# EAGLE design TMC2209_Camera_Slider_PCB_revB (EAGLE 9.6.2)
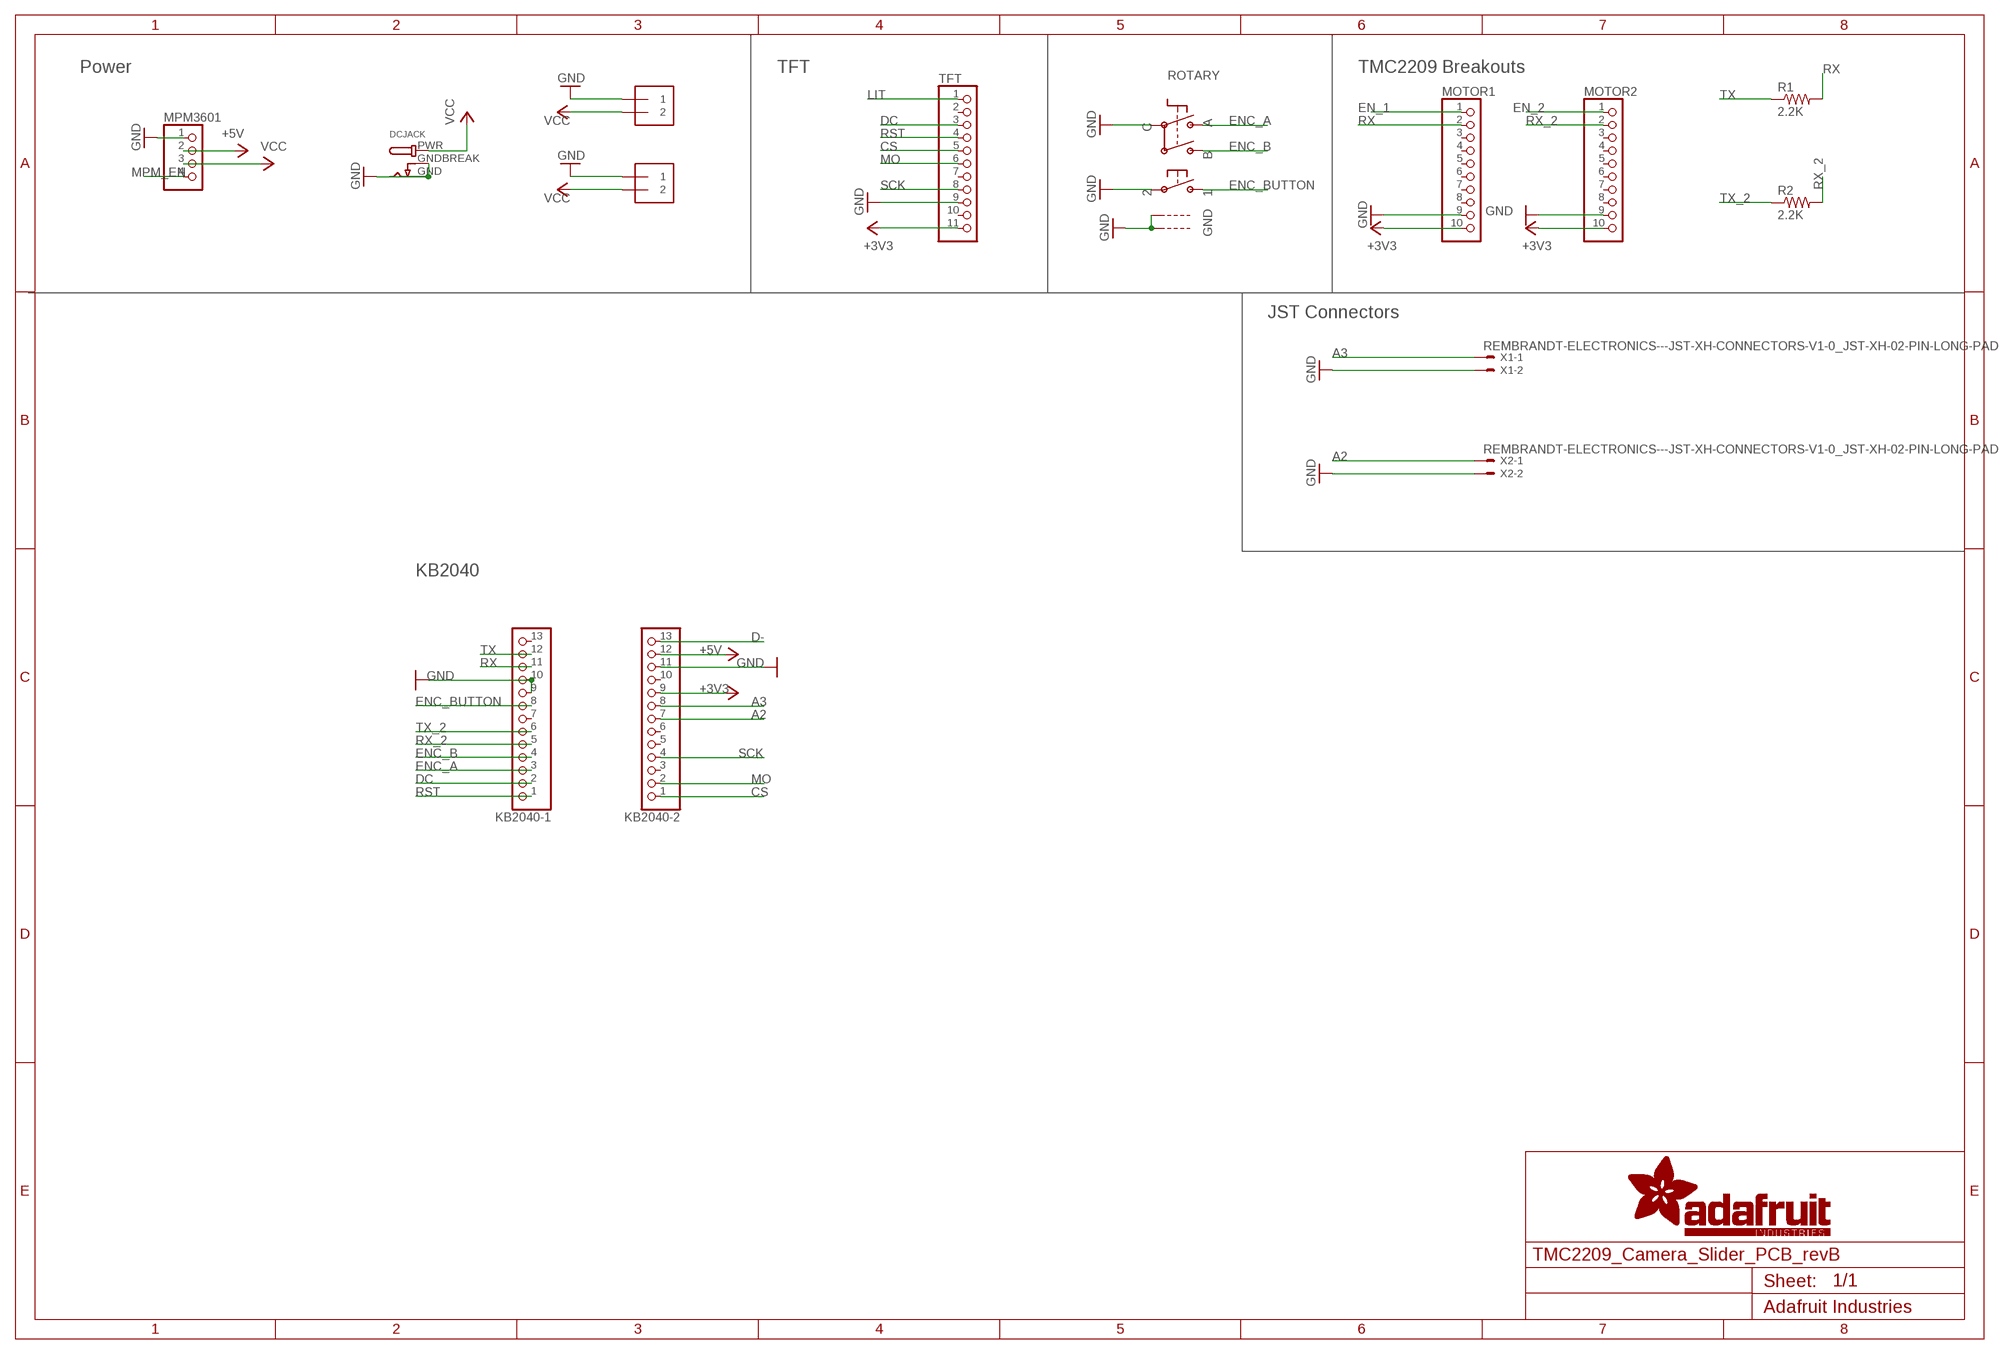
[diagram p0: schematic, sheet 1]

## Parts
DCJACK  DCBARRELPTH  [DCJACK_2MM_PTH]
J1  1X2-3.5MM  [1X2-3.5MM]
J2  1X2-3.5MM  [1X2-3.5MM]
KB2040-1  HEADER-1X13  [1X13_ROUND_70]
KB2040-2  HEADER-1X13  [1X13_ROUND_70]
MOTOR1  HEADER-1X10  [1X10_OVAL]
MOTOR2  HEADER-1X10  [1X10_OVAL]
MPM3601  HEADER-1X4  [1X04_OVAL]
R1  2.2K  R-US_0309/12  [0309/12]
R2  2.2K  R-US_0309/12  [0309/12]
ROTARY  ENCODER_PLUS_SWITCH_BOURNS_PEC11  [PEC11+SWITCH]
TFT  HEADER-1X11  [1X11_ROUND]
X1  REMBRANDT-ELECTRONICS---JST-XH-CONNECTORS-V1-0_JST-XH-02-PIN-LONG-PAD  [REMBRANDT-ELECTRONICS---JST-XH-CONNECTORS-V1-0_JST-XH-02-PACKAGE-LONG-PAD]
X2  REMBRANDT-ELECTRONICS---JST-XH-CONNECTORS-V1-0_JST-XH-02-PIN-LONG-PAD  [REMBRANDT-ELECTRONICS---JST-XH-CONNECTORS-V1-0_JST-XH-02-PACKAGE-LONG-PAD]

## Nets
+3V3: KB2040-2.9 MOTOR1.10 MOTOR2.10 TFT.11
+5V: KB2040-2.12 MPM3601.2
A2: KB2040-2.7 X2.1
A3: KB2040-2.8 X1.1
CS: KB2040-2.1 TFT.5
D-: KB2040-2.13
DC: KB2040-1.2 TFT.3
EN_1: MOTOR1.1
EN_2: MOTOR2.1
ENC_A: KB2040-1.3 ROTARY.P$A
ENC_B: KB2040-1.4 ROTARY.P$B
ENC_BUTTON: KB2040-1.8 ROTARY.P$1
GND: DCJACK.GND DCJACK.GNDBREAK J1.1 J2.1 KB2040-1.9 KB2040-1.10 KB2040-2.11 MOTOR1.9 MOTOR2.9 MPM3601.1 ROTARY.P$2 ROTARY.P$C ROTARY.P$GND1 ROTARY.P$GND2 TFT.9 X1.2 X2.2
LIT: TFT.1
MO: KB2040-2.2 TFT.6
MPM_EN: MPM3601.4
RST: KB2040-1.1 TFT.4
RX: KB2040-1.11 MOTOR1.2 R1.2
RX_2: KB2040-1.5 MOTOR2.2 R2.2
SCK: KB2040-2.4 TFT.8
TX: KB2040-1.12 R1.1
TX_2: KB2040-1.6 R2.1
VCC: DCJACK.PWR J1.2 J2.2 MPM3601.3
Unconnected: KB2040-1.7 KB2040-1.13 KB2040-2.3 KB2040-2.5 KB2040-2.6 KB2040-2.10 MOTOR1.3 MOTOR1.4 MOTOR1.5 MOTOR1.6 MOTOR1.7 MOTOR1.8 MOTOR2.3 MOTOR2.4 MOTOR2.5 MOTOR2.6 MOTOR2.7 MOTOR2.8 TFT.2 TFT.7 TFT.10

## Notes on the sheet
- Power | TFT | TMC2209 Breakouts
- JST Connectors
- KB2040

## Library data of the parts
DCJACK = adafruit_electromech:DCBARREL: DC Barrel Jack DCJACK_1.3MM_PTH - Through Hole 1.3mm Jack (4UConnector: 05536) DCJACK_2MM_PTH - Through Hole 2.0/2.1 Jack (4UConnector: 05537) DCJACK_2MM_SMT - SMT 2.0/2.1mm Jack(4UConnector: 03267)
J1 J2 = adafruit:1X2: 3.5mm Terminal block http://www.ladyada.net/library/pcb/eaglelibrary.html
KB2040-1 KB2040-2 = microbuilder:HEADER-1X13
MOTOR1 MOTOR2 = microbuilder:HEADER-1X10: PIN HEADER
MPM3601 = microbuilder:HEADER-1X4: PIN HEADER
R1 R2 = adafruit:R-US_: RESISTOR, American symbol
ROTARY = adafruit_electromech:ENCODER_PLUS_SWITCH: Rotary Encoder with Built-In Switch PEC11 - 24 Step, PEC11-4215F-S24 - http://www.adafruit.com/products/377
TFT = microbuilder:HEADER-1X11
X1 X2 = thermalBonnet:REMBRANDT-ELECTRONICS---JST-XH-CONNECTORS-V1-0_JST-XH-02-PIN: JST XH Connector 2 Pin Wire to board connector. Pitch: 2,54 mm, (0.100") Number of pins: 2 Created by Rembrandt Electronics www.rembrandtelectronics.com

## Board
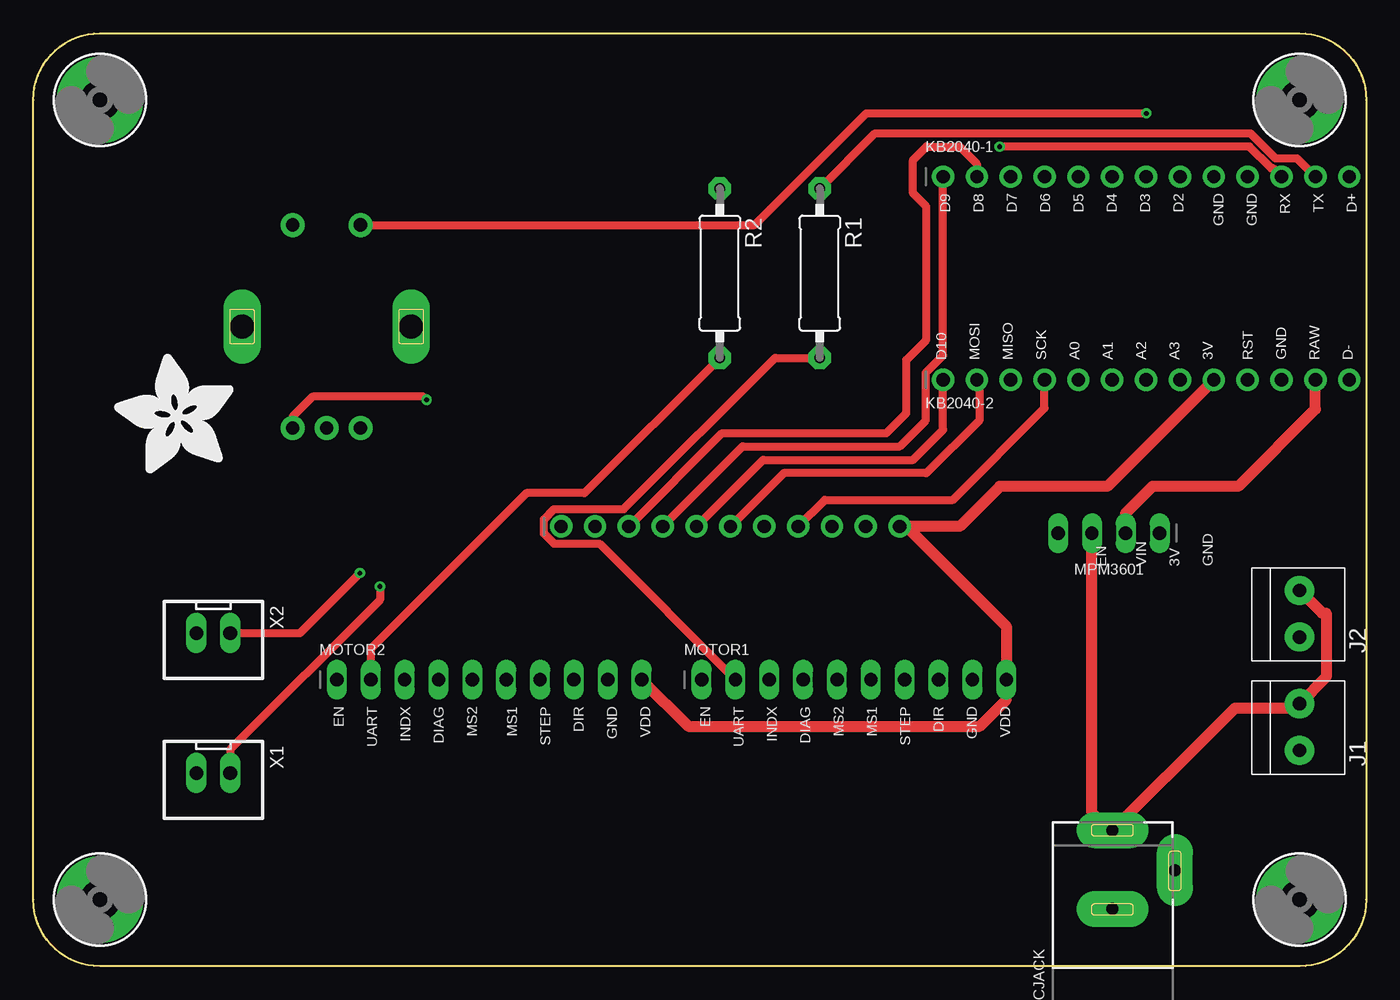
[diagram p1: board, top side]
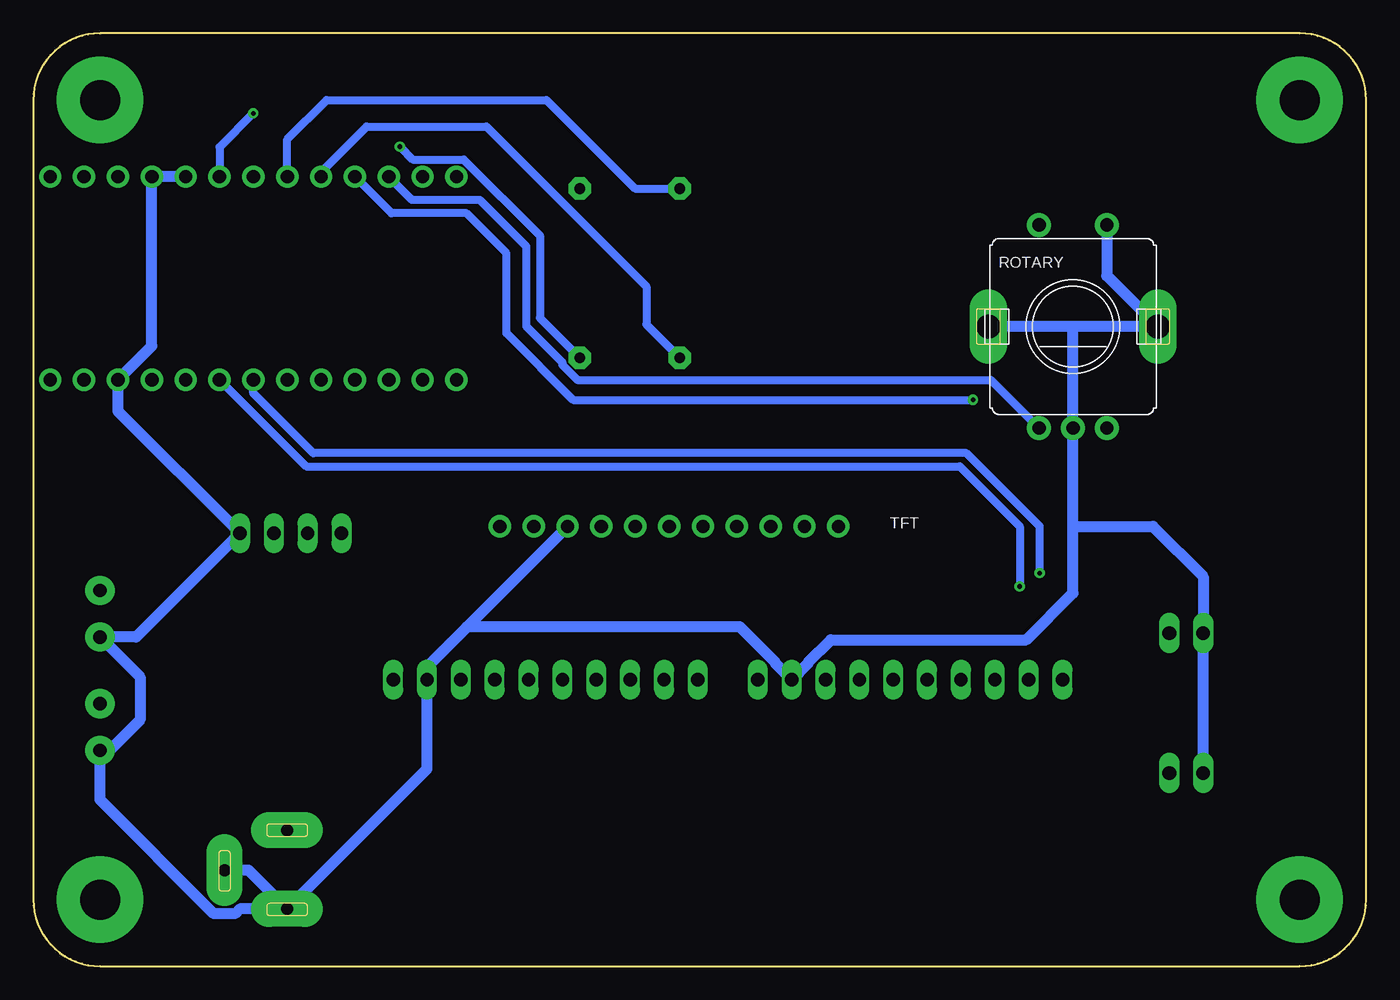
[diagram p2: board, bottom side, seen from below]

Size 100 x 70 mm. Coordinates in mm from the lower left corner, seen from the top.
Outline: 95,0 5,0 arc-90 0,5 0,65 arc-90 5,70 95,70 arc-90 100,65 100,5 arc-90 95,0
Copper layers (1*16): Top 0.035mm / dielectric 1.5mm / Bottom 0.035mm
Design rules "default *": minimum track width 6mil, minimum drill 0.35mm, track to track 6mil, track to pad 6mil, pad to pad 6mil, via to via 6mil, smd to smd 6mil, copper to edge 10mil, drill to drill 6mil, minimum pad ring 10mil, minimum via ring 8mil, stop-mask expansion 4mil, vias tented up to drill 0mil, thermal gap 10mil

### Footprints (pad centres in the part's own frame; a part is rotated, then mirrored left to right if it is on the bottom)
DCJACK_2MM_PTH = drill 0.9 pad 2.7 long: GND -2.9,2.54; GNDBREAK 0,-2.16; PWR 3,2.54
MOUNTINGHOLE_3.0_PLATED = drill 3 pad 6.452: P$1 0,0
1X2-3.5MM = drill 1 pad 2.184: 1 1.8,0; 2 -1.7,0
1X13_ROUND_70 = drill 1 pad 1.676: 1 -15.24,0; 2 -12.7,0; 3 -10.16,0; 4 -7.62,0; 5 -5.08,0; 6 -2.54,0; 7 0,0; 8 2.54,0; 9 5.08,0; 10 7.62,0; 11 10.16,0; 12 12.7,0; 13 15.24,0
1X10_OVAL = drill 1 long: 1 -11.43,0; 2 -8.89,0; 3 -6.35,0; 4 -3.81,0; 5 -1.27,0; 6 1.27,0; 7 3.81,0; 8 6.35,0; 9 8.89,0; 10 11.43,0
1X04_OVAL = drill 1 long: 1 -3.81,0; 2 -1.27,0; 3 1.27,0; 4 3.81,0
0309/12 = drill 0.813 pad 1.676 octagon: 1 -6.35,0; 2 6.35,0
PEC11+SWITCH = drill 1 pad 1.8: P$1 -2.54,7.62; P$2 2.54,7.62; P$A -2.54,-7.62; P$B 2.54,-7.62; P$C 0,-7.62 | drill 1.8 pad 2.8 long: P$GND1 -6.35,0; P$GND2 6.35,0
1X11_ROUND = drill 1 pad 1.676: 1 -12.7,0; 2 -10.16,0; 3 -7.62,0; 4 -5.08,0; 5 -2.54,0; 6 0,0; 7 2.54,0; 8 5.08,0; 9 7.62,0; 10 10.16,0; 11 12.7,0
REMBRANDT-ELECTRONICS---JST-XH-CONNECTORS-V1-0_JST-XH-02-PACKAGE-LONG-PAD = drill 1.016 long: 1 -1.27,0; 2 1.27,0

### Placement (x,y rotation side)
DCJACK  83.5,7.2 90 top
E$1  [MOUNTINGHOLE_3.0_PLATED]  5,65 0 top
E$2  [MOUNTINGHOLE_3.0_PLATED]  95,65 0 top
E$3  [MOUNTINGHOLE_3.0_PLATED]  95,5 0 top
E$5  [MOUNTINGHOLE_3.0_PLATED]  5,5 0 top
J1  95,18 270 top
J2  95,26.5 270 top
KB2040-1  83.49,59.24 0 top
KB2040-2  83.49,44 0 top
MOTOR1  61.57,21.5 0 top
MOTOR2  34.21,21.5 0 top
MPM3601  80.69,32.5 180 top
PLABEL0  [PLABEL0]  88,19 0 top
PLABEL1  [PLABEL6]  49,52.5 90 top
PLABEL2  [PLABEL2]  61.5,25 0 top
PLABEL3  [PLABEL3]  34,25 0 top
PLABEL4  [PLABEL4]  4.5,15.5 0 top
PLABEL5  [PLABEL5]  4.5,24 0 top
PLABEL6  [PLABEL6]  56.5,52.5 90 top
PLABEL7  [PLABEL1]  87,23.5 0 top
PLABEL8  [PLABEL8]  84.5,35 0 top
PLABEL9  [PLABEL9]  79.5,35 0 top
PLABEL10  [PLABEL10]  45.5,18 90 top
PLABEL11  [PLABEL11]  73,18 90 top
PLABEL12  [PLABEL12]  83.5,52 0 top
PLABEL13  [PLABEL13]  98.5,52 90 top
PLABEL14  [PLABEL14]  80.5,29.5 0 top
PLABEL15  [PLABEL15]  78,14 0 top
PLABEL16  [PLABEL16]  95,12 0 top
PLABEL17  [PLABEL17]  75.5,51 0 top
PLABEL18  [PLABEL18]  39.5,8 0 top
PLABEL19  [PLABEL19]  67,8 0 top
PLABEL21  [PLABEL21]  12.5,59.5 0 top
PLABEL24  [PLABEL24]  23,57 0 bottom
PLABEL25  [PLABEL25]  53,37.5 0 bottom
PLABEL26  [PLABEL26]  65,30.5 0 bottom
PLABEL27  [PLABEL27]  60,30.5 0 bottom
PLABEL28  [PLABEL28]  57.25,30.5 0 bottom
PLABEL29  [PLABEL29]  52.25,30.5 0 bottom
PLABEL30  [PLABEL30]  54.75,30.5 0 bottom
PLABEL31  [PLABEL31]  49.75,30.5 0 bottom
PLABEL32  [PLABEL32]  47.25,30.5 0 bottom
PLABEL33  [PLABEL33]  44.75,30.5 0 bottom
PLABEL34  [PLABEL34]  44.75,29.5 0 bottom
PLABEL35  [PLABEL35]  47.25,29.5 0 bottom
PLABEL36  [PLABEL36]  49.75,29.5 0 bottom
PLABEL41  [PLABEL41]  40.5,7 0 bottom
PLABEL42  [PLABEL42]  12,56.5 15 bottom
PLABEL43  [PLABEL43]  34.5,42.5 15 bottom
PLABEL44  [PLABEL44]  18,60.5 15 bottom
PLABEL45  [PLABEL45]  54,61 15 bottom
PLABEL46  [PLABEL46]  39,16.5 15 bottom
PLABEL47  [PLABEL47]  90,29 15 bottom
PLABEL48  [PLABEL48]  86,48.5 15 bottom
PLABEL49  [PLABEL49]  83,25 15 bottom
PLABEL50  [PLABEL50]  27,67 15 bottom
PLABEL51  [PLABEL51]  17.5,31 15 bottom
PLABEL52  [PLABEL52]  4,26.5 15 bottom
PLABEL53  [PLABEL53]  72.5,4 15 bottom
PLABEL54  [PLABEL54]  75.5,29 15 bottom
PLABEL55  [PLABEL55]  87.5,37.5 15 bottom
PLABEL56  [PLABEL56]  72,53.5 15 bottom
PLABEL57  [PLABEL57]  55,52.5 15 bottom
PLABEL58  [PLABEL58]  57,4 15 bottom
PLABEL59  [PLABEL59]  86,68 15 bottom
PLABEL60  [PLABEL60]  85,55.5 15 bottom
PLABEL61  [PLABEL61]  33.5,52.5 345 bottom
PLABEL62  [PLABEL62]  44.5,53.5 345 bottom
PLABEL63  [PLABEL63]  4,58.5 345 bottom
PLABEL64  [PLABEL64]  11,47 345 bottom
PLABEL65  [PLABEL65]  6.5,39 345 bottom
PLABEL66  [PLABEL66]  76,48 345 bottom
PLABEL67  [PLABEL67]  35.5,60 345 bottom
PLABEL68  [PLABEL68]  65.5,14 345 bottom
PLABEL69  [PLABEL69]  46,62 345 bottom
PLABEL70  [PLABEL70]  14.5,6.5 345 bottom
PLABEL71  [PLABEL71]  85.5,17.5 345 bottom
PLABEL72  [PLABEL72]  53.5,27.5 345 bottom
PLABEL73  [PLABEL73]  35,29 345 bottom
PLABEL74  [PLABEL74]  28.5,36 345 bottom
PLABEL75  [PLABEL75]  16.5,68 345 bottom
PLABEL76  [PLABEL76]  61,67 345 top
PLABEL77  [PLABEL77]  25.5,60 15 top
PLABEL78  [PLABEL78]  3.5,48.5 15 top
PLABEL79  [PLABEL79]  91,12.5 15 top
PLABEL80  [PLABEL80]  19.5,14.5 15 top
PLABEL81  [PLABEL81]  23,3 15 top
PLABEL82  [PLABEL82]  38.5,65 15 top
PLABEL83  [PLABEL83]  76,19.5 15 top
PLABEL84  [PLABEL84]  94,53.5 15 top
PLABEL85  [PLABEL85]  76.5,65.5 15 top
PLABEL86  [PLABEL86]  37.5,47 15 top
PLABEL87  [PLABEL87]  9,62.5 345 top
PLABEL88  [PLABEL88]  5.5,32 345 top
PLABEL89  [PLABEL89]  2.5,12 345 top
PLABEL90  [PLABEL90]  41,39 345 top
PLABEL91  [PLABEL91]  48.5,66.5 345 top
PLABEL92  [PLABEL92]  92.5,33 345 top
PLABEL93  [PLABEL93]  47,48.5 345 top
PLABEL94  [PLABEL0]  88,27.5 0 top
PLABEL95  [PLABEL1]  87,15.5 0 top
PLABEL96  [PLABEL16]  95.5,33 0 top
PLABEL200  [PLABEL200]  50,60 0 top
PLABEL201  [PLABEL201]  49.5,45 90 top
PLABEL202  [PLABEL202]  13,65 0 top
PLABEL203  [PLABEL203]  17.5,38.5 0 bottom
PLABEL204  [PLABEL204]  29,38.5 0 bottom
R1  59,52 270 top
R2  51.5,52 270 top
ROTARY  22,48 0 bottom
TFT  52.3,33 0 top
U$1  [ADAFRUIT_9MM]  15,37 90 top
X1  13.5,14.5 180 top
X2  13.5,25 180 top

### Tracks (layer width: path | path; a pad name or v marks a point on that pad's centre or on a via)
+3V3
  Top 0.813: MOTOR2.10 49.14,18 71,18 73,20 MOTOR1.10 73,25.5 65.5,33 TFT.11 69.5,33 72.5,36 80.57,36 KB2040-2.9
+5V
  Top 0.813: MPM3601.2 81.96,34 83.96,36 90.39,36 96.19,41.8 KB2040-2.12
A2  (via drill 0.35)
  Top 0.61: X2.1 20,25 v24.5,29.5
  Bottom 0.61: v24.5,29.5 24.5,33 30,38.5 79,38.5 83.49,42.99 KB2040-2.7
A3  (via drill 0.35)
  Top 0.61: v26,28.5 26,27.5 14.77,16.27 X1.1
  Bottom 0.61: KB2040-2.8 79.53,37.5 30.5,37.5 26,33 v26,28.5
CS
  Top 0.61: TFT.5 54.76,38 66,38 68.25,40.25 KB2040-2.1
DC
  Top 0.61: TFT.3 51.68,40 64,40 65.5,41.5 65.5,45.5 67,47 67,57 66,58 66,60.5 67,61.5 69.5,61.5 70.79,60.21 KB2040-1.2
ENC_A
  Bottom 0.61: ROTARY.P$A 28.16,44 59.18,44 60.3,45.11 60.3,45.3 63,48 63,54 66.5,57.5 71.59,57.5 KB2040-1.3
ENC_B  (via drill 0.35)
  Top 0.61: ROTARY.P$B 19.46,41.26 20.94,42.74 29.26,42.74 v29.5,42.5
  Bottom 0.61: v29.5,42.5 59.5,42.5 64.5,47.5 64.5,53.5 67.5,56.5 73.13,56.5 KB2040-1.4
ENC_BUTTON  (via drill 0.35)
  Top 0.61: ROTARY.P$1 54.12,55.62 62.5,64 v83.5,64
  Bottom 0.61: v83.5,64 86.03,61.47 KB2040-1.8
GND
  Bottom 0.813: DCJACK.GND 70.46,14.8 MOTOR1.9 70.46,22.46 67.46,25.46 | TFT.9 67.46,25.46 | KB2040-1.9 KB2040-1.10 91.11,46.54 KB2040-2.11 93.65,41.65 MPM3601.1 92.3,24.7 J2.1 92,21.7 92,18.5 95,15.5 | 22,48 ROTARY.P$GND2 19.46,51.81 ROTARY.P$2 | 22,48 ROTARY.P$GND1 | 22,48 ROTARY.P$C 22,33 | 67.46,25.46 46.99,25.46 44.33,22.8 44.33,22.73 MOTOR2.9 41.87,22.73 41.87,22.8 40.17,24.5 25.5,24.5 22,28 22,33 | DCJACK.GND 84.51,4.3 84.87,3.94 86.45,3.94 95,12.49 95,15.5 | 95,15.5 J1.1 | DCJACK.GND 83.86,7.2 DCJACK.GNDBREAK | X1.2 X2.2 12.23,29.23 16,33 22,33
MO
  Top 0.61: KB2040-2.2 71,43.79 71,41 67,37 56.3,37 TFT.6
RST
  Top 0.61: TFT.4 53.22,39 65,39 66.95,40.95 66.95,44.54 68.25,45.83 KB2040-1.1
RX  (via drill 0.35)
  Top 0.61: R1.2 55.65,45.65 44.3,34.3 39.06,34.3 38.3,33.54 38.3,32.46 39.06,31.7 42.48,31.7 MOTOR1.2 | KB2040-1.11 93.02,59.87 92.88,59.87 91.24,61.5 v72.5,61.5
  Bottom 0.61: v72.5,61.5 71.53,60.53 67.71,60.53 62,54.82 62,48.65 R1.2
RX_2
  Top 0.61: R2.2 41.35,35.5 37,35.5 25.32,23.82 MOTOR2.2
  Bottom 0.61: KB2040-1.5 78.41,59.59 75,63 66,63 54,51 54,48.15 R2.2
SCK
  Top 0.61: TFT.8 59.38,35 69,35 75.87,41.87 KB2040-2.4
TX
  Top 0.61: R1.1 63.15,62.5 91.32,62.5 93.19,60.63 94.8,60.63 KB2040-1.12
TX_2
  Bottom 0.61: KB2040-1.6 80.95,62.05 78,65 61.5,65 54.85,58.35 R2.1
VCC
  Top 0.813: MPM3601.3 79.42,11.5 80.72,10.2 DCJACK.PWR 84.96,14.2 85,14.2 90.15,19.35 94.65,19.35 J1.2 97,21.7 97,26.5 96.7,26.5 J2.2

### Text on the board
tNames: D9 | D8 | D7 | D6 | D5 | D4 | D3 | D2 | GND | GND | RX | TX | D+ | D10 | MOSI | MISO | SCK | A0 | A1 | A2 | A3 | 3V | RST | GND | RAW | D- | EN | VIN | 3V | GND | EN | UART | INDX | DIAG | MS2 | MS1 | STEP | DIR | GND | VDD | EN | UART | INDX | DIAG | MS2 | MS1 | STEP | DIR | GND | VDD
Pinguin_tBackup: v0, April 2025 | 📸 | 2.2K | 🐗 | KB2040 | USB | V+ | 3.3V | GND | MOTOR 2 | MOTOR 1 | A2 | MPM3601 | V+ | ⚡ | 3.3V | 3.3V | A3 | ⚡ | GND | ⚙️ | ⚙️
Pinguin_bBackup: 📷 | 🎥 | 📷 | 📷 | 🎥 | 🎥 | Camera Slider / Helper | 📷 | 📷 | 🎥 | 📷 | D2 | 📷 | 📷 | 📷 | 📷 | 🎥 | 📷 | 📷 | 🎥 | 🎥 | 📷 | 📷 | 🎥 | 📷 | 📷 | 🎥 | D3 | D4 | 🎥 | TFT / DISPLAY | 📷 | 📷 | 📷 | 🎥 | DC | RST | CS | MO | MI | SCK | GND | 3.3V | 📷 | D8 | D9 | D10 | 📷 | 📷 | 📷 | 📷 | 📷 | 📷 | 🎥 | 📷 | 🎥 | 📷 | 📷 | 🎥 | 🎥 | 📷 | MS2 | MS1 | MS2 | MS1 | 🎥 | 📷 | 📷 | 📷 | 🎥 | 🎥 | 📷
Pinguin_tBackup: v1, April 2025 | D4 | D5
Pinguin_bBackup: D6 | D7